# EAGLE design PGTN020_envelope4 (EAGLE 9.6.0)
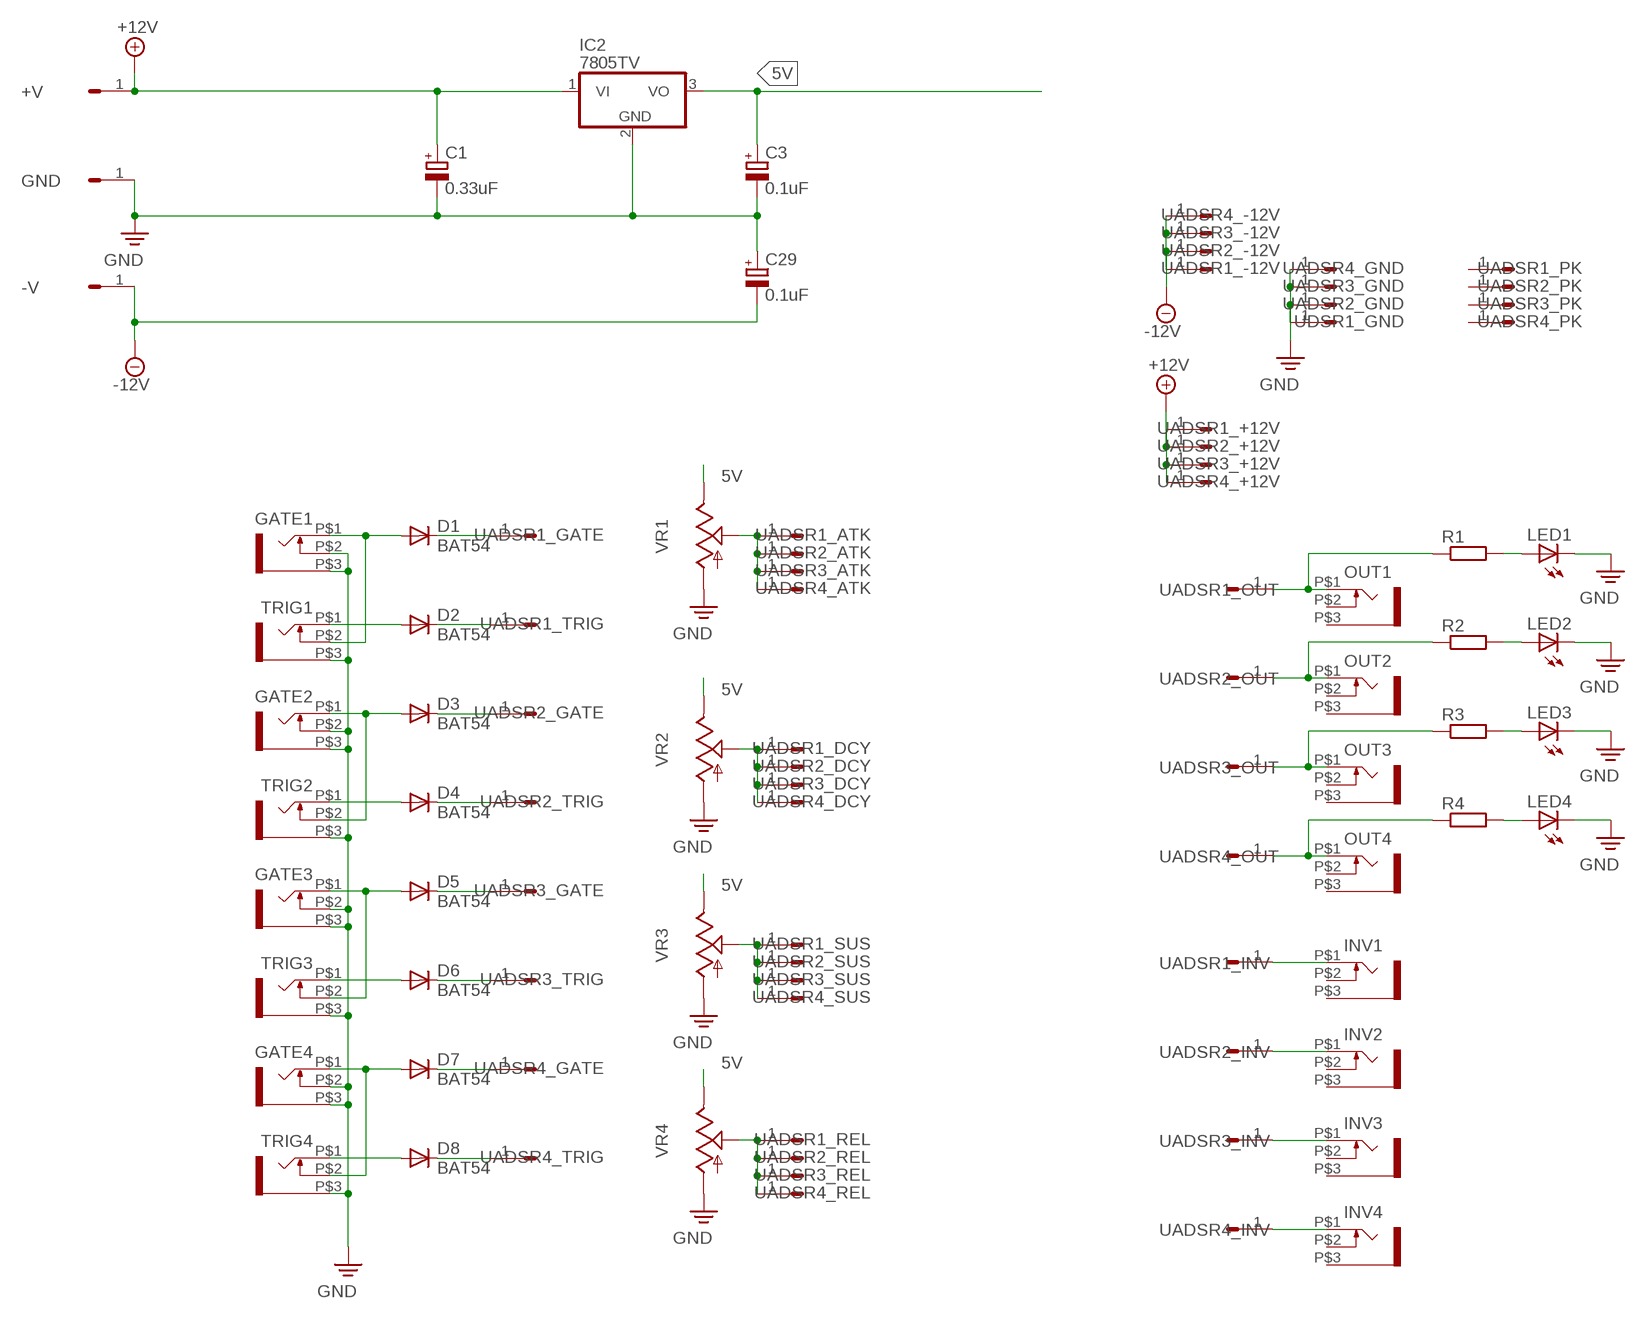
[diagram p0: schematic, sheet 1]

## Parts
+V  HEADER/MALE/01  [HEADER/MALE/01]
-V  HEADER/MALE/01  [HEADER/MALE/01]
C1  0.33uF  CAPACITOR/POLARIZEDE2.5-6  [E2,5-6]
C3  0.1uF  CAPACITOR/POLARIZEDE2.5-6  [E2,5-6]
C29  0.1uF  CAPACITOR/POLARIZEDE2.5-6  [E2,5-6]
D1  BAT54  1N4148DO35-7  [DO35-7]
D2  BAT54  1N4148DO35-7  [DO35-7]
D3  BAT54  1N4148DO35-7  [DO35-7]
D4  BAT54  1N4148DO35-7  [DO35-7]
D5  BAT54  1N4148DO35-7  [DO35-7]
D6  BAT54  1N4148DO35-7  [DO35-7]
D7  BAT54  1N4148DO35-7  [DO35-7]
D8  BAT54  1N4148DO35-7  [DO35-7]
GATE1  WQP-PJ301M-12_JACK  [WQP-PJ301M-12_JACK]
GATE2  WQP-PJ301M-12_JACK  [WQP-PJ301M-12_JACK]
GATE3  WQP-PJ301M-12_JACK  [WQP-PJ301M-12_JACK]
GATE4  WQP-PJ301M-12_JACK  [WQP-PJ301M-12_JACK]
GND  HEADER/MALE/01  [HEADER/MALE/01]
IC2  7805TV  [TO220V]
INV1  WQP-PJ301M-12_JACK  [WQP-PJ301M-12_JACK]
INV2  WQP-PJ301M-12_JACK  [WQP-PJ301M-12_JACK]
INV3  WQP-PJ301M-12_JACK  [WQP-PJ301M-12_JACK]
INV4  WQP-PJ301M-12_JACK  [WQP-PJ301M-12_JACK]
LED1  LED5MM  [LED5MM]
LED2  LED5MM  [LED5MM]
LED3  LED5MM  [LED5MM]
LED4  LED5MM  [LED5MM]
OUT1  WQP-PJ301M-12_JACK  [WQP-PJ301M-12_JACK]
OUT2  WQP-PJ301M-12_JACK  [WQP-PJ301M-12_JACK]
OUT3  WQP-PJ301M-12_JACK  [WQP-PJ301M-12_JACK]
OUT4  WQP-PJ301M-12_JACK  [WQP-PJ301M-12_JACK]
R1  RESISTORRESISTOR/UPRIGHT/7.5  [RESISTOR/7.5]
R2  RESISTORRESISTOR/UPRIGHT/7.5  [RESISTOR/7.5]
R3  RESISTORRESISTOR/UPRIGHT/7.5  [RESISTOR/7.5]
R4  RESISTORRESISTOR/UPRIGHT/7.5  [RESISTOR/7.5]
TRIG1  WQP-PJ301M-12_JACK  [WQP-PJ301M-12_JACK]
TRIG2  WQP-PJ301M-12_JACK  [WQP-PJ301M-12_JACK]
TRIG3  WQP-PJ301M-12_JACK  [WQP-PJ301M-12_JACK]
TRIG4  WQP-PJ301M-12_JACK  [WQP-PJ301M-12_JACK]
UADSR1_+12V  HEADER/MALE/01  [HEADER/MALE/01]
UADSR1_-12V  HEADER/MALE/01  [HEADER/MALE/01]
UADSR1_ATK  HEADER/MALE/01  [HEADER/MALE/01]
UADSR1_DCY  HEADER/MALE/01  [HEADER/MALE/01]
UADSR1_GATE  HEADER/MALE/01  [HEADER/MALE/01]
UADSR1_INV  HEADER/MALE/01  [HEADER/MALE/01]
UADSR1_OUT  HEADER/MALE/01  [HEADER/MALE/01]
UADSR1_PK  HEADER/MALE/01  [HEADER/MALE/01]
UADSR1_REL  HEADER/MALE/01  [HEADER/MALE/01]
UADSR1_SUS  HEADER/MALE/01  [HEADER/MALE/01]
UADSR1_TRIG  HEADER/MALE/01  [HEADER/MALE/01]
UADSR2_+12V  HEADER/MALE/01  [HEADER/MALE/01]
UADSR2_-12V  HEADER/MALE/01  [HEADER/MALE/01]
UADSR2_ATK  HEADER/MALE/01  [HEADER/MALE/01]
UADSR2_DCY  HEADER/MALE/01  [HEADER/MALE/01]
UADSR2_GATE  HEADER/MALE/01  [HEADER/MALE/01]
UADSR2_GND  HEADER/MALE/01  [HEADER/MALE/01]
UADSR2_INV  HEADER/MALE/01  [HEADER/MALE/01]
UADSR2_OUT  HEADER/MALE/01  [HEADER/MALE/01]
UADSR2_PK  HEADER/MALE/01  [HEADER/MALE/01]
UADSR2_REL  HEADER/MALE/01  [HEADER/MALE/01]
UADSR2_SUS  HEADER/MALE/01  [HEADER/MALE/01]
UADSR2_TRIG  HEADER/MALE/01  [HEADER/MALE/01]
UADSR3_+12V  HEADER/MALE/01  [HEADER/MALE/01]
UADSR3_-12V  HEADER/MALE/01  [HEADER/MALE/01]
UADSR3_ATK  HEADER/MALE/01  [HEADER/MALE/01]
UADSR3_DCY  HEADER/MALE/01  [HEADER/MALE/01]
UADSR3_GATE  HEADER/MALE/01  [HEADER/MALE/01]
UADSR3_GND  HEADER/MALE/01  [HEADER/MALE/01]
UADSR3_INV  HEADER/MALE/01  [HEADER/MALE/01]
UADSR3_OUT  HEADER/MALE/01  [HEADER/MALE/01]
UADSR3_PK  HEADER/MALE/01  [HEADER/MALE/01]
UADSR3_REL  HEADER/MALE/01  [HEADER/MALE/01]
UADSR3_SUS  HEADER/MALE/01  [HEADER/MALE/01]
UADSR3_TRIG  HEADER/MALE/01  [HEADER/MALE/01]
UADSR4_+12V  HEADER/MALE/01  [HEADER/MALE/01]
UADSR4_-12V  HEADER/MALE/01  [HEADER/MALE/01]
UADSR4_ATK  HEADER/MALE/01  [HEADER/MALE/01]
UADSR4_DCY  HEADER/MALE/01  [HEADER/MALE/01]
UADSR4_GATE  HEADER/MALE/01  [HEADER/MALE/01]
UADSR4_GND  HEADER/MALE/01  [HEADER/MALE/01]
UADSR4_INV  HEADER/MALE/01  [HEADER/MALE/01]
UADSR4_OUT  HEADER/MALE/01  [HEADER/MALE/01]
UADSR4_PK  HEADER/MALE/01  [HEADER/MALE/01]
UADSR4_REL  HEADER/MALE/01  [HEADER/MALE/01]
UADSR4_SUS  HEADER/MALE/01  [HEADER/MALE/01]
UADSR4_TRIG  HEADER/MALE/01  [HEADER/MALE/01]
UDSR1_GND  HEADER/MALE/01  [HEADER/MALE/01]
VR1  9MM_SNAP-IN_POT_  [9MM_SNAP-IN_POT]
VR2  9MM_SNAP-IN_POT_  [9MM_SNAP-IN_POT]
VR3  9MM_SNAP-IN_POT_  [9MM_SNAP-IN_POT]
VR4  9MM_SNAP-IN_POT_  [9MM_SNAP-IN_POT]

## Nets
5V: C3.+ IC2.3(VO) VR1.3(E) VR2.3(E) VR3.3(E) VR4.3(E)
+12V: +V.1 C1.+ IC2.1(VI) UADSR1_+12V.1 UADSR2_+12V.1 UADSR3_+12V.1 UADSR4_+12V.1
-12V: -V.1 C29.- UADSR1_-12V.1 UADSR2_-12V.1 UADSR3_-12V.1 UADSR4_-12V.1
N$1: OUT3.P$1 R3.1 UADSR3_OUT.1
N$2: OUT4.P$1 R4.1 UADSR4_OUT.1
N$3: INV1.P$1 UADSR1_INV.1
N$4: INV2.P$1 UADSR2_INV.1
N$5: INV3.P$1 UADSR3_INV.1
N$6: INV4.P$1 UADSR4_INV.1
N$7: D1.C UADSR1_GATE.1
N$8: D2.C UADSR1_TRIG.1
N$9: D1.A GATE1.P$1 TRIG1.P$2
N$10: D2.A TRIG1.P$1
N$11: D3.A GATE2.P$1 TRIG2.P$2
N$12: D4.A TRIG2.P$1
N$13: D5.A GATE3.P$1 TRIG3.P$2
N$14: D6.A TRIG3.P$1
N$15: D7.A GATE4.P$1 TRIG4.P$2
N$16: D8.A TRIG4.P$1
N$17: OUT1.P$1 R1.1 UADSR1_OUT.1
N$18: OUT2.P$1 R2.1 UADSR2_OUT.1
N$19: UADSR1_ATK.1 UADSR2_ATK.1 UADSR3_ATK.1 UADSR4_ATK.1 VR1.2(S)
N$20: UADSR1_DCY.1 UADSR2_DCY.1 UADSR3_DCY.1 UADSR4_DCY.1 VR2.2(S)
N$21: UADSR1_SUS.1 UADSR2_SUS.1 UADSR3_SUS.1 UADSR4_SUS.1 VR3.2(S)
N$22: UADSR1_REL.1 UADSR2_REL.1 UADSR3_REL.1 UADSR4_REL.1 VR4.2(S)
N$23: D3.C UADSR2_GATE.1
N$24: D4.C UADSR2_TRIG.1
N$25: D5.C UADSR3_GATE.1
N$26: D6.C UADSR3_TRIG.1
N$27: D7.C UADSR4_GATE.1
N$28: D8.C UADSR4_TRIG.1
N$29: LED1.A R1.2
N$30: LED2.A R2.2
N$31: LED3.A R3.2
N$32: LED4.A R4.2
PE: C1.- C3.- C29.+ GATE1.P$2 GATE1.P$3 GATE2.P$2 GATE2.P$3 GATE3.P$2 GATE3.P$3 GATE4.P$2 GATE4.P$3 GND.1 IC2.2(GND) LED1.K(C) LED2.K(C) LED3.K(C) LED4.K(C) TRIG1.P$3 TRIG2.P$3 TRIG3.P$3 TRIG4.P$3 UADSR2_GND.1 UADSR3_GND.1 UADSR4_GND.1 UDSR1_GND.1 VR1.1(A) VR2.1(A) VR3.1(A) VR4.1(A) ; supply symbol labelled GND
Unconnected: INV1.P$2 INV1.P$3 INV2.P$2 INV2.P$3 INV3.P$2 INV3.P$3 INV4.P$2 INV4.P$3 OUT1.P$2 OUT1.P$3 OUT2.P$2 OUT2.P$3 OUT3.P$2 OUT3.P$3 OUT4.P$2 OUT4.P$3 UADSR1_PK.1 UADSR2_PK.1 UADSR3_PK.1 UADSR4_PK.1

## Library data of the parts
+V -V GND UADSR1_+12V UADSR1_-12V UADSR1_ATK UADSR1_DCY UADSR1_GATE UADSR1_INV UADSR1_OUT UADSR1_PK UADSR1_REL UADSR1_SUS UADSR1_TRIG UADSR2_+12V UADSR2_-12V UADSR2_ATK UADSR2_DCY UADSR2_GATE UADSR2_GND UADSR2_INV UADSR2_OUT UADSR2_PK UADSR2_REL UADSR2_SUS UADSR2_TRIG UADSR3_+12V UADSR3_-12V UADSR3_ATK UADSR3_DCY UADSR3_GATE UADSR3_GND UADSR3_INV UADSR3_OUT UADSR3_PK UADSR3_REL UADSR3_SUS UADSR3_TRIG UADSR4_+12V UADSR4_-12V UADSR4_ATK UADSR4_DCY UADSR4_GATE UADSR4_GND UADSR4_INV UADSR4_OUT UADSR4_PK UADSR4_REL UADSR4_SUS UADSR4_TRIG UDSR1_GND = connectors:HEADER/MALE/01; SPICEPREFIX: X
C1 C3 C29 = capacitors:CAPACITOR/POLARIZED: POLARIZED CAPACITOR, European symbol; SPICEPREFIX: C
D1-D8 = transistors:1N4148: DIODE high speed (Philips)
GATE1-GATE4 INV1-INV4 OUT1-OUT4 TRIG1-TRIG4 = controls:WQP-PJ301M-12_JACK
IC2 = ic_voltage_reg:78*: Positive VOLTAGE REGULATOR Source: http://cache.national.com/ds/LM/LM78L05.pdf http://www.fairchildsemi.com/ds/LM/LM7805.pdf
LED1-LED4 = display_led:LED: LED OSRAM: - CHIPLED LG R971, LG N971, LY N971, LG Q971, LY Q971, LO R971, LY R971 LH N974, LH R974 LS Q976, LO Q976, LY Q976 LO Q996 - Hyper CHIPLED LW Q18S LB Q993, LB Q99A, LB R99A - SideLED LS A670, LO A670, LY A670, LG A670, LP A670 LB A673, LV A673, LT A673, LW A673 LH A674 LY A675 LS A676, LA A676, LO A676, LY A676, LW A676 LS A679, LY A679, LG A679 - Hyper Micro SIDELED® LS Y876, LA Y876, LO Y876, LY Y876 LT Y87S - SmartLED LW L88C, LW L88S LB L89C, LB L89S, LG L890 LS L89K, LO L89K, LY L89K LS L896, LA L896, LO L896, LY L896 - TOPLED LS T670, LO T670, LY T670, LG T670, LP T670 LSG T670, LSP T670, LSY T670, LOP T670, LYG T670 LG T671, LOG T671, LSG T671 LB T673, LV T673, LT T673, LW T673 LH T674 LS T676, LA T676, LO T676, LY T676, LB T676, LH T676, LSB T676, LW T676 LB T67C, LV T67C, LT T67C, LS T67K, LO T67K, LY T67K, LW E67C LS E67B, LA E67B, LO E67B, LY E67B, LB E67C, LV E67C, LT E67C LW T67C LS T679, LY T679, LG T679 LS T770, LO T770, LY T770, LG T770, LP T770 LB T773, LV T773, LT T773, LW T773 LH T774 LS E675, LA E675, LY E675, LS T675 LS T776, LA T776, LO T776, LY T776, LB T776 LHGB T686 LT T68C, LB T68C - Hyper Mini TOPLED® LB M676 - Mini TOPLED Santana® LG M470 LS M47K, LO M47K, LY M47K Source: http://www.osram.convergy.de LUXEON: - LUMILED® LXK2-PW12-R00, LXK2-PW12-S00, LXK2-PW14-U00, LXK2-PW14-V00 LXK2-PM12-R00, LXK2-PM12-S00, LXK2-PM14-U00 LXK2-PE12-Q00, LXK2-PE12-R00, LXK2-PE12-S00, LXK2-PE14-T00, LXK2-PE14-U00 LXK2-PB12-K00, LXK2-PB12-L00, LXK2-PB12-M00, LXK2-PB14-N00, LXK2-PB14-P00, LXK2-PB14-Q00 LXK2-PR12-L00, LXK2-PR12-M00, LXK2-PR14-Q00, LXK2-PR14-R00 LXK2-PD12-Q00, LXK2-PD12-R00, LXK2-PD12-S00 LXK2-PH12-R00, LXK2-PH12-S00 LXK2-PL12-P00, LXK2-PL12-Q00, LXK2-PL12-R00 Source: www.luxeon.com KINGBRIGHT: KA-3528ASYC Source: www.kingbright.com
R1-R4 = resistors:RESISTOR: RESISTOR, European symbol
VR1-VR4 = controls:9MM_SNAP-IN_POT: 9mm vertical snap-in pot, Alpha / Panasonic style

## Board
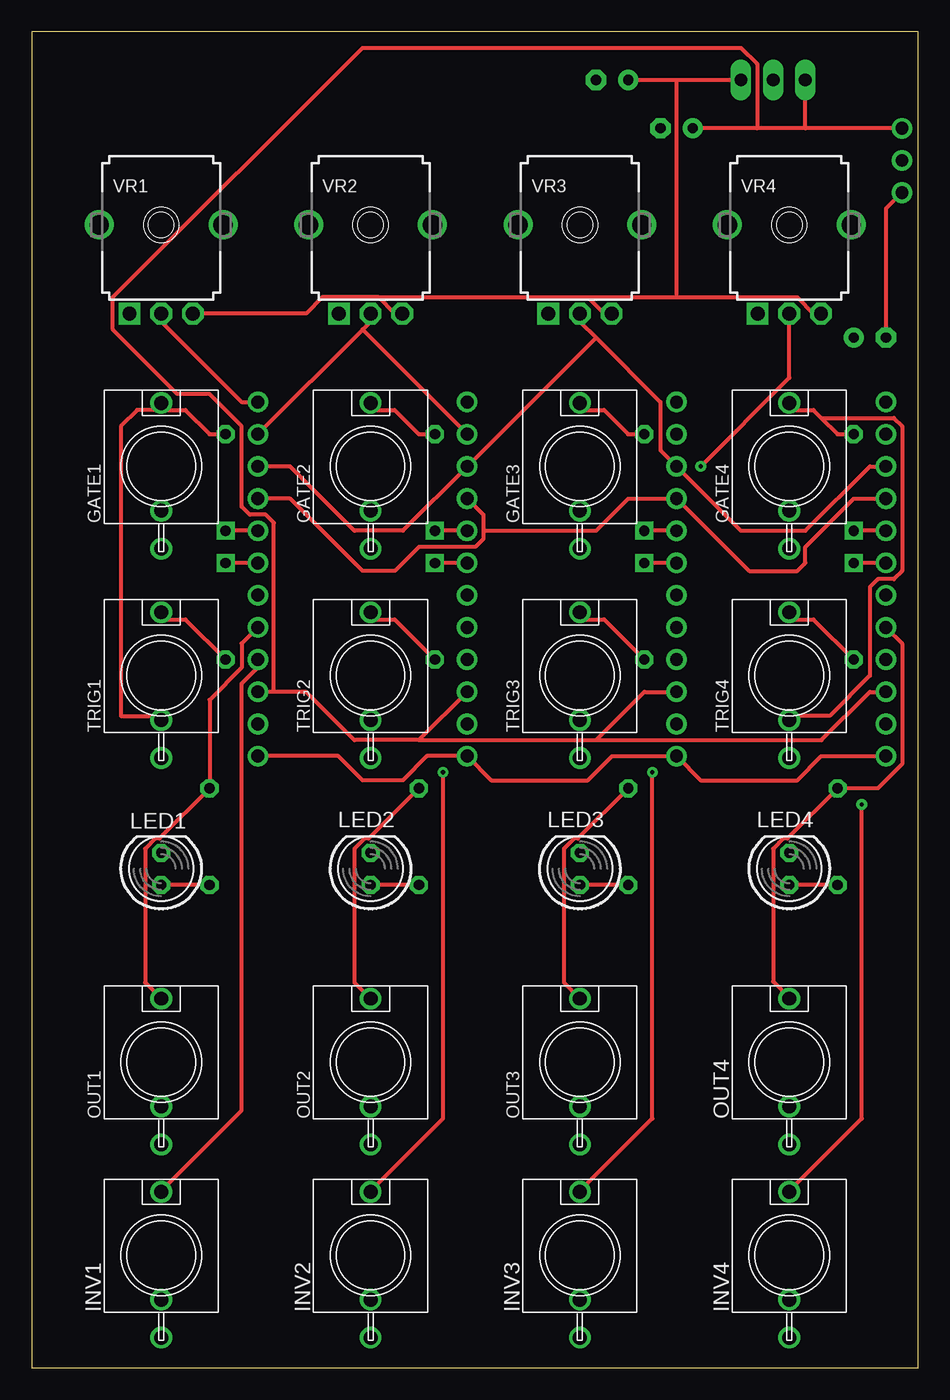
[diagram p1: board, top side]
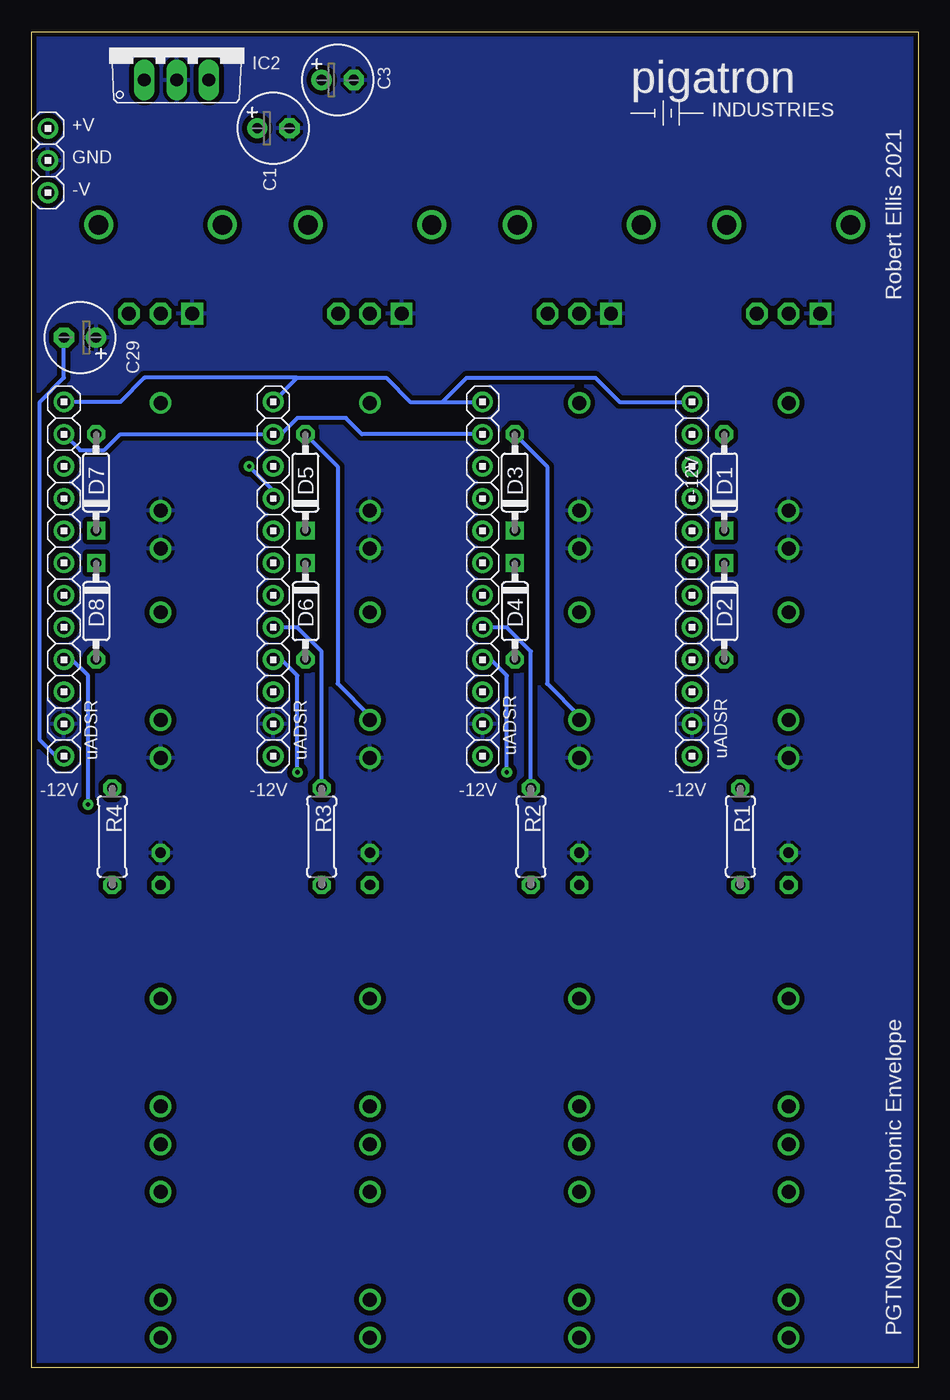
[diagram p2: board, bottom side, seen from below]

Size 69.9 x 105.4 mm. Coordinates in mm from the lower left corner, seen from the top.
Outline: 69.9,105.4 0,105.4 0,0 69.9,0 69.9,105.4
Copper layers (1*16): Top 0.0356mm / dielectric 1.5011mm / Bottom 0.0356mm
Design rules "pigatron": minimum track width 12mil, minimum drill 13mil, track to track 15mil, track to pad 10mil, pad to pad 10mil, via to via 10mil, smd to smd 6mil, copper to edge 15mil, drill to drill 10mil, minimum pad ring 12mil, minimum via ring 10mil, stop-mask expansion 4mil, vias tented up to drill 0mil, thermal gap 10mil

### Footprints (pad centres in the part's own frame; a part is rotated, then mirrored left to right if it is on the bottom)
HEADER/MALE/01 = drill 1.016: 1 0,0
E2,5-6 = drill 0.813 pad 1.6: + -1.27,0 | drill 0.813 pad 1.6 octagon: - 1.27,0
DO35-7 = drill 0.813 octagon: A 3.81,0 | drill 0.813 square: C -3.81,0
WQP-PJ301M-12_JACK = drill 1.1: P$1 0,5; P$2 0,-3.5; P$3 0,-6.5
TO220V = drill 1.016 long: 1 -2.54,-2.54; 2 0,-2.54; 3 2.54,-2.54
LED5MM = drill 0.813 octagon: A -1.27,0; K 1.27,0
RESISTOR/7.5 = drill 0.813 octagon: 1 -3.81,0; 2 3.81,0
9MM_SNAP-IN_POT = drill 1.1 square: 1 -2.5,-7 | drill 1.1 octagon: 2 0,-7; 3 2.5,-7 | drill 1.524 pad 2.286: CHASSIS1 -4.881,0; CHASSIS2 4.881,0

### Placement (x,y rotation side)
+V  68.63,97.78 0 bottom
-V  68.63,92.7 0 bottom
C1  50.85,97.78 0 bottom
C3  45.77,101.59 0 bottom
C29  66.09,81.27 180 bottom
D1  15.29,69.84 90 bottom
D2  15.29,59.68 270 bottom
D3  31.8,69.84 90 bottom
D4  31.8,59.68 270 bottom
D5  48.31,69.84 90 bottom
D6  48.31,59.68 270 bottom
D7  64.82,69.84 90 bottom
D8  64.82,59.68 270 bottom
GATE1  10.21,71.11 0 top
GATE2  26.72,71.11 0 top
GATE3  43.23,71.11 0 top
GATE4  59.74,71.11 0 top
GND  68.63,95.24 0 bottom
IC2  58.47,104.13 0 bottom
INV1  10.21,8.88 0 top
INV2  26.72,8.88 0 top
INV3  43.23,8.88 0 top
INV4  59.74,8.88 0 top
LED1  10.21,39.36 90 top
LED2  26.72,39.36 90 top
LED3  43.23,39.36 90 top
LED4  59.74,39.36 90 top
OUT1  10.21,24.12 0 top
OUT2  26.72,24.12 0 top
OUT3  43.23,24.12 0 top
OUT4  59.74,24.12 0 top
R1  14.02,41.9 270 bottom
R2  30.53,41.9 270 bottom
R3  47.04,41.9 270 bottom
R4  63.55,41.9 270 bottom
TRIG1  10.21,54.6 0 top
TRIG2  26.72,54.6 0 top
TRIG3  43.23,54.6 0 top
TRIG4  59.74,54.6 0 top
U$5  [PIGATRON-LOGO]  13.77,100.57 0 bottom
UADSR1_+12V  34.34,53.33 0 bottom
UADSR1_-12V  34.34,48.25 270 bottom
UADSR1_ATK  17.83,76.19 0 bottom
UADSR1_DCY  17.83,73.65 0 bottom
UADSR1_GATE  17.83,66.03 0 bottom
UADSR1_INV  17.83,55.87 0 bottom
UADSR1_OUT  17.83,58.41 0 bottom
UADSR1_PK  17.83,60.95 0 bottom
UADSR1_REL  17.83,68.57 0 bottom
UADSR1_SUS  17.83,71.11 0 bottom
UADSR1_TRIG  17.83,63.49 0 bottom
UADSR2_+12V  17.83,53.33 0 bottom
UADSR2_-12V  17.83,48.25 270 bottom
UADSR2_ATK  34.34,76.19 0 bottom
UADSR2_DCY  34.34,73.65 0 bottom
UADSR2_GATE  34.34,66.03 0 bottom
UADSR2_GND  17.83,50.79 0 bottom
UADSR2_INV  34.34,55.87 0 bottom
UADSR2_OUT  34.34,58.41 0 bottom
UADSR2_PK  34.34,60.95 0 bottom
UADSR2_REL  34.34,68.57 0 bottom
UADSR2_SUS  34.34,71.11 0 bottom
UADSR2_TRIG  34.34,63.49 0 bottom
UADSR3_+12V  50.85,53.33 270 bottom
UADSR3_-12V  50.85,48.25 270 bottom
UADSR3_ATK  50.85,76.19 0 bottom
UADSR3_DCY  50.85,73.65 0 bottom
UADSR3_GATE  50.85,66.03 0 bottom
UADSR3_GND  50.85,50.79 270 bottom
UADSR3_INV  50.85,55.87 0 bottom
UADSR3_OUT  50.85,58.41 0 bottom
UADSR3_PK  50.85,60.95 0 bottom
UADSR3_REL  50.85,68.57 0 bottom
UADSR3_SUS  50.85,71.11 0 bottom
UADSR3_TRIG  50.85,63.49 0 bottom
UADSR4_+12V  67.36,53.33 270 bottom
UADSR4_-12V  67.36,48.25 270 bottom
UADSR4_ATK  67.36,76.19 0 bottom
UADSR4_DCY  67.36,73.65 0 bottom
UADSR4_GATE  67.36,66.03 0 bottom
UADSR4_GND  67.36,50.79 270 bottom
UADSR4_INV  67.36,55.87 0 bottom
UADSR4_OUT  67.36,58.41 0 bottom
UADSR4_PK  67.36,60.95 0 bottom
UADSR4_REL  67.36,68.57 0 bottom
UADSR4_SUS  67.36,71.11 0 bottom
UADSR4_TRIG  67.36,63.49 0 bottom
UDSR1_GND  34.34,50.79 0 bottom
VR1  10.21,90.16 0 top
VR2  26.72,90.16 0 top
VR3  43.23,90.16 0 top
VR4  59.74,90.16 0 top

### Tracks (layer width: path | path; a pad name or v marks a point on that pad's centre or on a via)
5V
  Top 0.305: IC2.3 50.85,101.59 | 50.85,101.59 C3.+ | 27.36,84.44 22.91,84.44 21.64,83.17 12.75,83.17 VR1.3 | 27.36,84.44 28.63,83.17 VR2.3 | 43.87,84.44 45.14,83.17 VR3.3 | 27.36,84.44 43.87,84.44 | 43.87,84.44 50.85,84.44 | 50.85,84.44 60.38,84.44 61.65,83.17 VR4.3 | 50.85,84.44 50.85,101.59
+12V
  Top 0.305: +V.1 61.01,97.78 | 61.01,97.78 57.2,97.78 | 57.2,97.78 C1.+ | 61.01,97.78 IC2.1 | 19.1,53.33 21.64,53.33 25.45,49.52 30.53,49.52 | 19.1,53.33 UADSR2_+12V.1 | UADSR1_+12V.1 30.53,49.52 | UADSR3_+12V.1 48.31,53.33 44.5,49.52 | 30.53,49.52 44.5,49.52 | UADSR4_+12V.1 66.09,53.33 62.28,49.52 44.5,49.52 | 57.2,97.78 57.2,102.86 55.93,104.13 26.09,104.13 6.4,84.44 6.4,81.91 11.48,76.82 14.02,76.82 16.56,74.28 16.56,67.93 17.2,67.3 18.47,67.3 19.1,66.66 19.1,53.33
-12V
  Top 0.305: C29.- 67.36,91.43 -V.1 | UADSR2_-12V.1 24.18,48.25 26.09,46.34 29.26,46.34 31.17,48.25 UADSR1_-12V.1 36.25,46.34 43.87,46.34 45.77,48.25 UADSR3_-12V.1 52.76,46.34 60.38,46.34 62.28,48.25 UADSR4_-12V.1
  Bottom 0.305: C29.- 67.36,78.09 69.27,76.19 69.27,49.52 68,48.25 UADSR4_-12V.1
N$1
  Top 0.305: R3.1 43.08,41.75 42.77,41.75 41.96,40.94 41.96,30.39 OUT3.P$1
  Bottom 0.305: UADSR3_OUT.1 48.95,58.41 47.04,56.51 R3.1
N$2
  Top 0.305: UADSR4_OUT.1 68.63,57.14 68.63,47.62 66.73,45.71 R4.1 59.59,41.75 59.28,41.75 58.47,40.94 58.47,30.47 59.74,29.2 OUT4.P$1
N$3
  Top 0.305: UADSR1_INV.1 17.83,55.23 16.56,53.97 16.56,20.31 10.21,13.96 INV1.P$1
N$4  (via drill 0.33)
  Top 0.305: v32.44,46.98 32.44,19.67 26.72,13.96 INV2.P$1
  Bottom 0.305: UADSR2_INV.1 33.71,55.87 32.44,54.6 v32.44,46.98
N$5  (via drill 0.33)
  Top 0.305: v48.95,46.98 48.95,19.67 43.23,13.96 INV3.P$1
  Bottom 0.305: UADSR3_INV.1 50.22,55.87 48.95,54.6 v48.95,46.98
N$6  (via drill 0.33)
  Top 0.305: v65.46,44.44 65.46,19.67 59.74,13.96 INV4.P$1
  Bottom 0.305: UADSR4_INV.1 66.73,55.87 65.46,54.6 v65.46,44.44
N$7
  Top 0.305: UADSR1_GATE.1 D1.C
N$8
  Top 0.305: UADSR1_TRIG.1 D2.C
N$9
  Top 0.305: D1.A 14.02,73.65 12.12,75.55 10.21,75.55 | 10.21,75.55 8.31,75.55 7.04,74.28 7.04,51.43 10.21,51.43 TRIG1.P$2 | 10.21,75.55 GATE1.P$1
N$10
  Top 0.305: D2.A 12.12,59.05 10.21,59.05 TRIG1.P$1
N$11
  Top 0.305: D3.A 30.53,73.65 28.63,75.55 26.72,75.55 GATE2.P$1
  Bottom 0.305: D3.A 29.26,71.11 29.26,53.97 26.72,51.43 TRIG2.P$2
N$12
  Top 0.305: D4.A 28.63,59.05 26.72,59.05 TRIG2.P$1
N$13
  Top 0.305: D5.A 47.04,73.65 45.14,75.55 43.23,75.55 GATE3.P$1
  Bottom 0.305: D5.A 45.77,71.11 45.77,53.97 43.23,51.43 TRIG3.P$2
N$14
  Top 0.305: D6.A 45.14,59.05 43.23,59.05 TRIG3.P$1
N$15
  Top 0.305: D7.A 63.55,73.65 62.28,74.92 | 62.28,74.92 61.65,75.55 59.74,75.55 GATE4.P$1 | 62.28,74.92 68,74.92 68.63,74.28 68.63,62.86 68,62.22 66.73,62.22 66.09,61.59 66.09,54.6 62.92,51.43 59.74,51.43 TRIG4.P$2
N$16
  Top 0.305: D8.A 61.65,59.05 59.74,59.05 TRIG4.P$1
N$17
  Top 0.305: UADSR1_OUT.1 16.56,57.14 16.56,55.23 14.02,52.7 R1.1 10.06,41.75 9.75,41.75 8.94,40.94 8.94,30.39 OUT1.P$1
N$18
  Top 0.305: R2.1 26.57,41.75 26.26,41.75 25.45,40.94 25.45,30.39 OUT2.P$1
  Bottom 0.305: UADSR2_OUT.1 32.44,58.41 30.53,56.51 R2.1
N$19
  Top 0.305: UADSR1_ATK.1 16.56,76.19 10.21,82.54 VR1.2
  Bottom 0.305: 37.52,76.19 40.06,76.19 41.96,78.09 48.95,78.09 | 37.52,76.19 UADSR2_ATK.1 | UADSR3_ATK.1 48.95,78.09 | UADSR4_ATK.1 62.92,76.19 61.01,78.09 48.95,78.09 | UADSR1_ATK.1 23.55,76.19 25.45,78.09 35.61,78.09 37.52,76.19
N$20
  Top 0.305: 26.09,81.91 26.72,82.54 VR2.2 | 26.09,81.91 UADSR1_DCY.1 | 26.09,81.91 UADSR2_DCY.1
  Bottom 0.305: UADSR4_DCY.1 66.09,72.38 64.19,72.38 62.92,73.65 UADSR3_DCY.1 50.22,73.65 48.95,74.92 45.14,74.92 43.87,73.65 UADSR2_DCY.1
N$21
  Top 0.305: UADSR1_SUS.1 20.37,71.11 25.45,66.03 29.26,66.03 UADSR2_SUS.1 44.5,81.27 | 44.5,81.27 43.23,82.54 VR3.2 | 44.5,81.27 49.58,76.19 49.58,72.38 UADSR3_SUS.1 55.93,66.03 61.01,66.03 66.09,71.11 UADSR4_SUS.1
N$22  (via drill 0.33)
  Top 0.305: UADSR1_REL.1 20.37,68.57 26.09,62.86 28.63,62.86 30.53,64.76 34.98,64.76 35.61,65.39 35.61,66.03 | 35.61,66.03 35.61,67.3 UADSR2_REL.1 | 35.61,66.03 44.5,66.03 47.04,68.57 UADSR3_REL.1 56.57,62.86 60.38,62.86 61.01,63.49 61.01,64.76 64.82,68.57 UADSR4_REL.1 | VR4.2 59.74,78.09 v52.76,71.11
  Bottom 0.305: v52.76,71.11 50.85,69.2 UADSR3_REL.1
N$23
  Top 0.305: UADSR2_GATE.1 D3.C
N$24
  Top 0.305: UADSR2_TRIG.1 D4.C
N$25
  Top 0.305: UADSR3_GATE.1 D5.C
N$26
  Top 0.305: UADSR3_TRIG.1 D6.C
N$27
  Top 0.305: UADSR4_GATE.1 D7.C
N$28
  Top 0.305: UADSR4_TRIG.1 D8.C
N$29
  Top 0.305: R1.2 LED1.A
N$30
  Top 0.305: R2.2 LED2.A
N$31
  Top 0.305: R3.2 LED3.A
N$32
  Top 0.305: R4.2 LED4.A
PE
  pour Bottom: 69.9,-0.01 0.05,-0.01 0.05,105.4 69.9,105.4

### Text on the board
bNames: Robert Ellis 2021 | -12V | uADSR | uADSR | uADSR | uADSR | -12V | -12V | -12V | -12V | PGTN020 Polyphonic Envelope